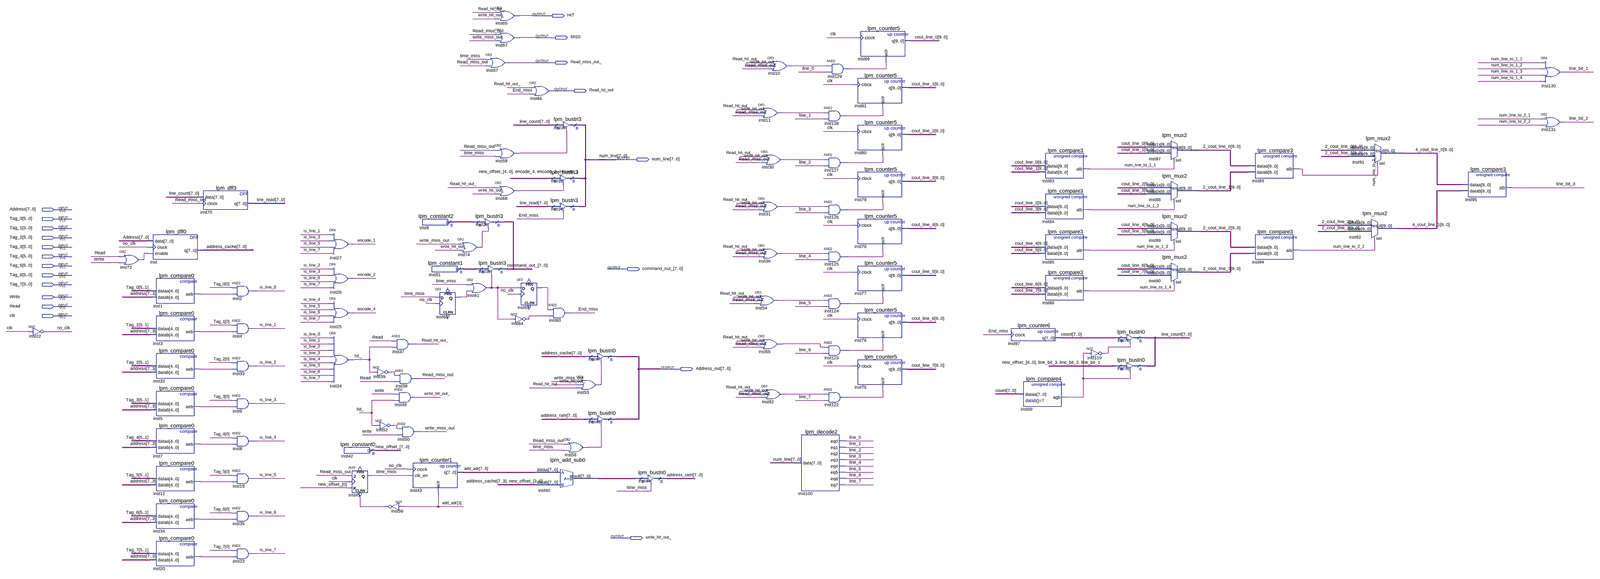
[diagram p0: schematic sheet, whole]
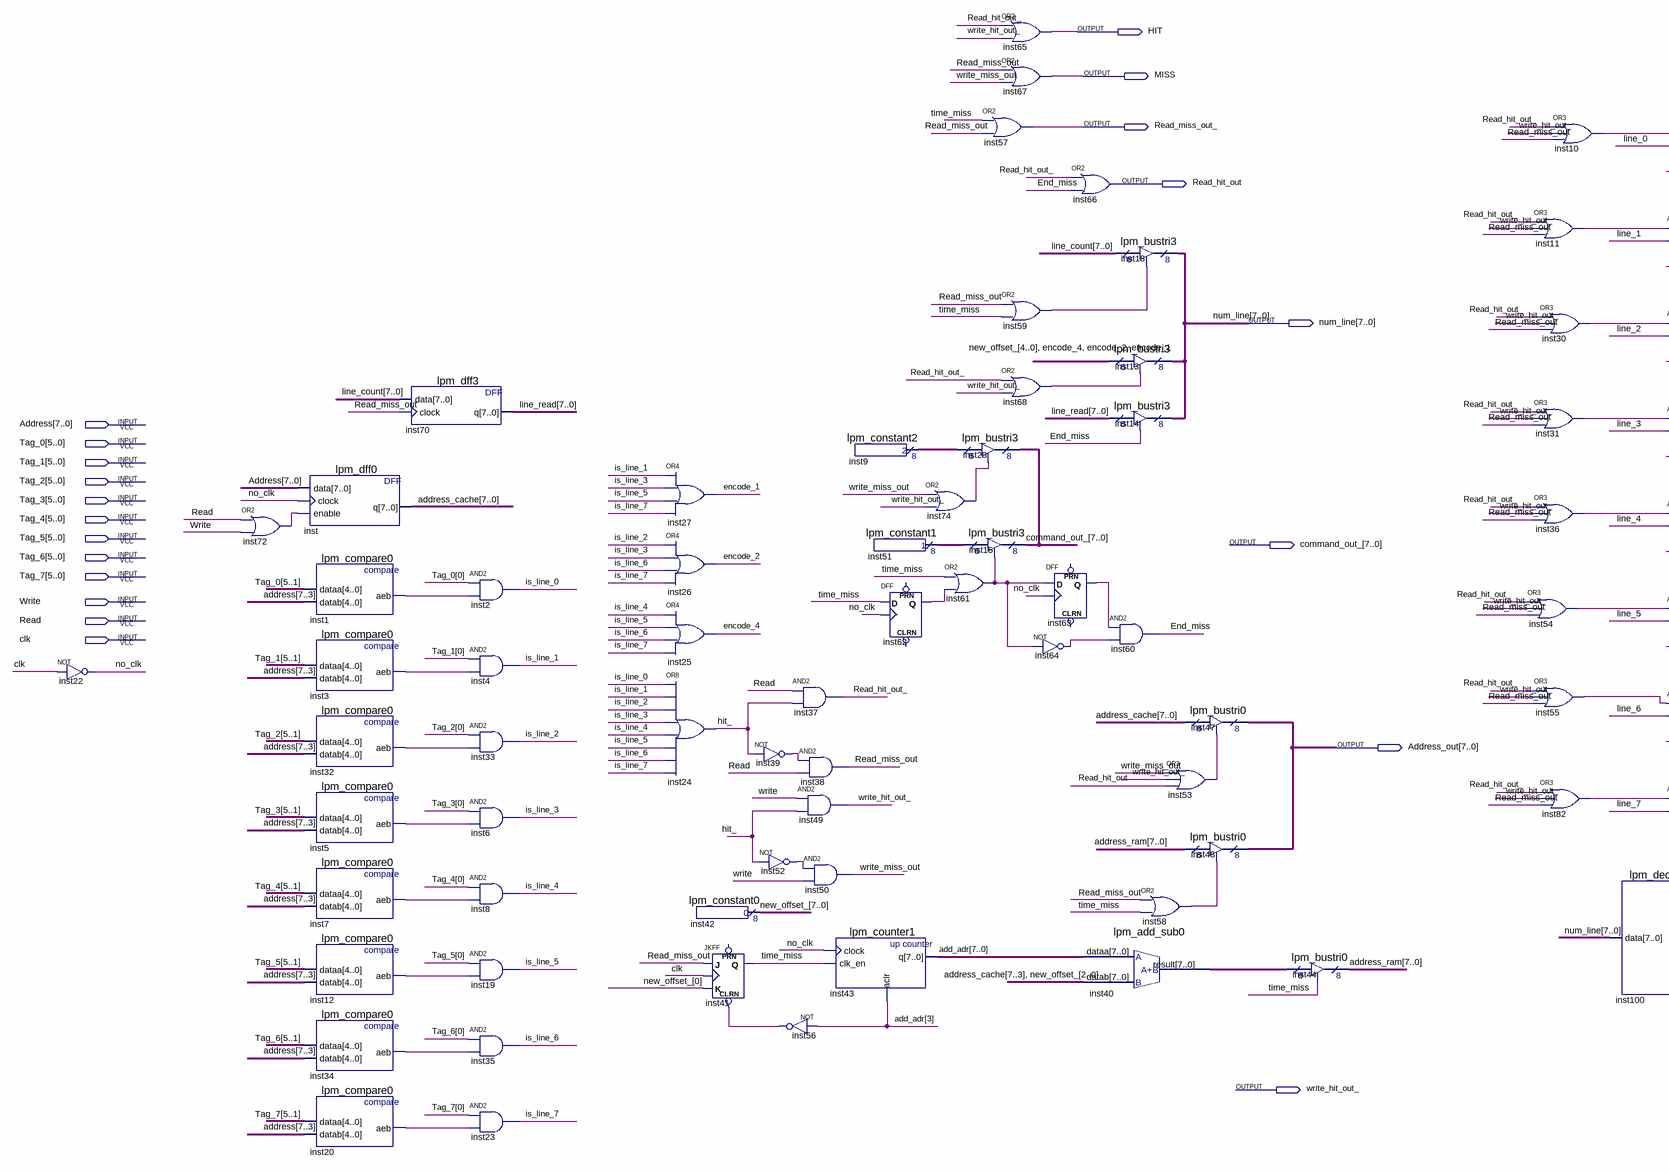
[diagram p1: schematic sheet, left part]
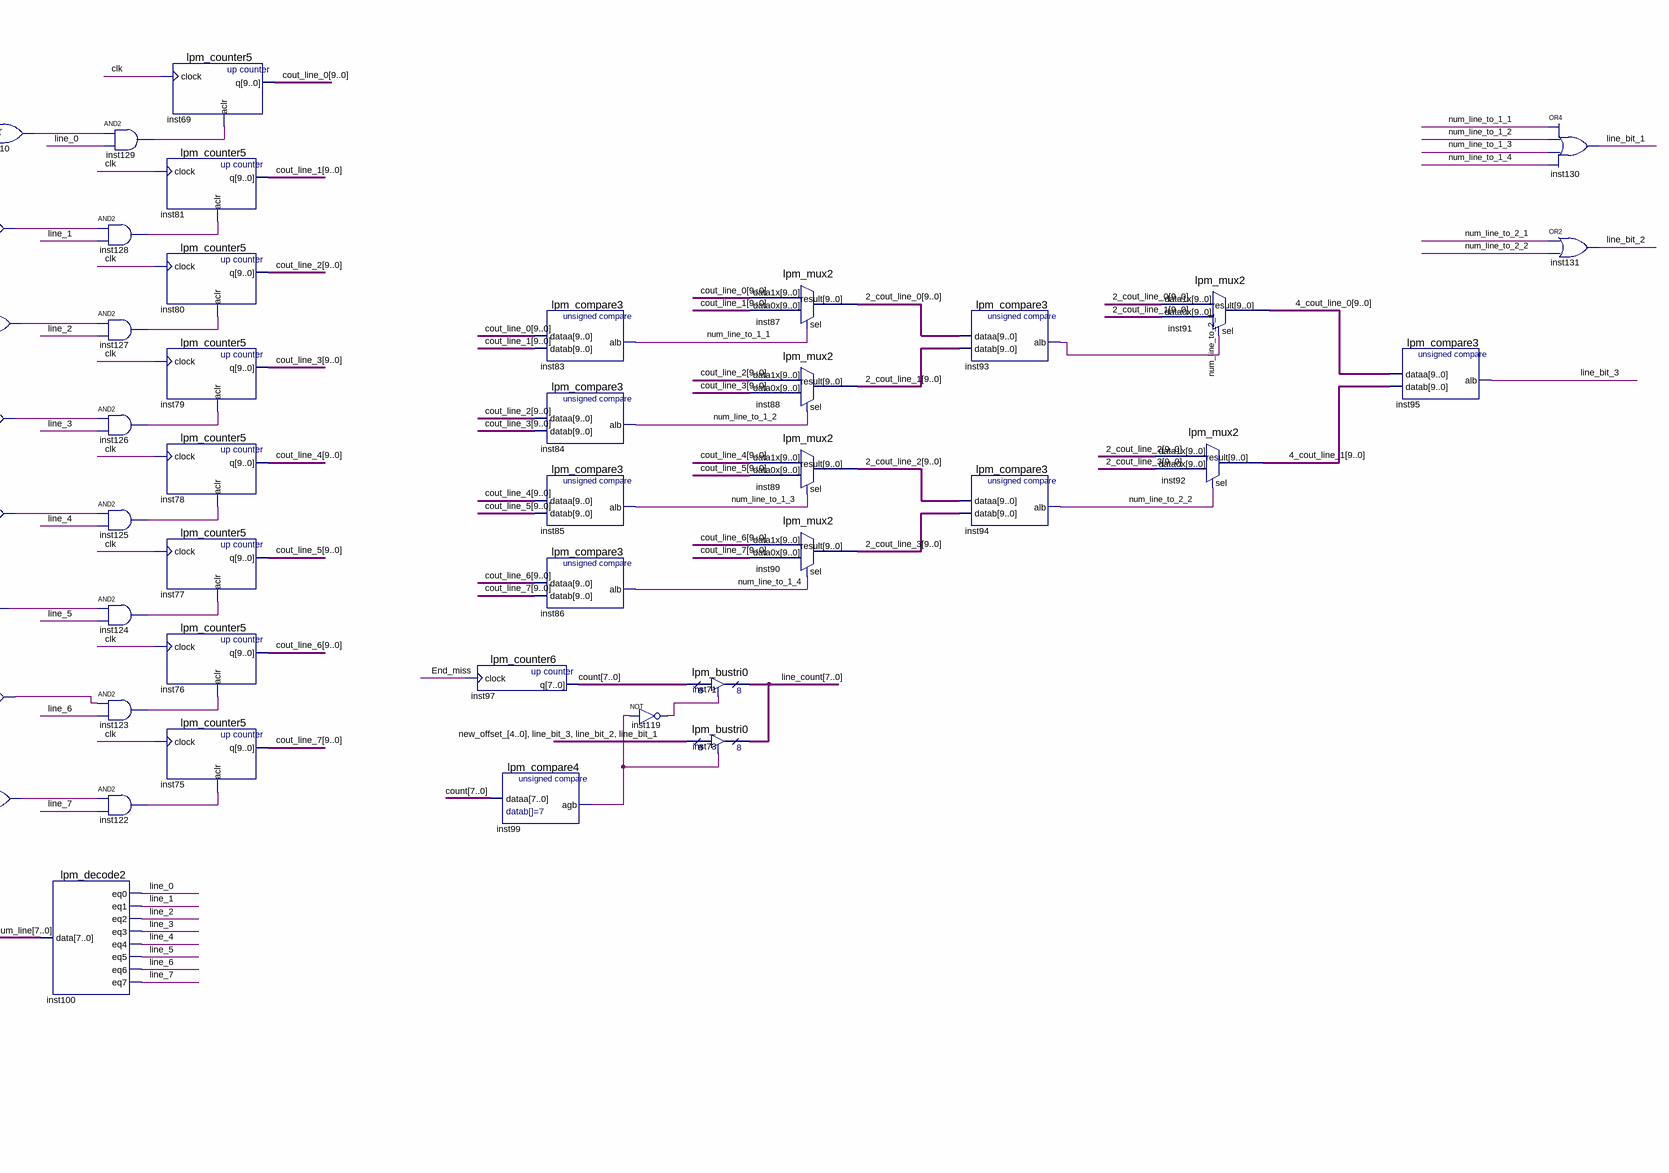
[diagram p2: schematic sheet, right part]
// Quartus schematic cache_control.bdf as structural Verilog: 104 symbols, 20 pins
module cache_control (
  input  [7:0] Address,
  input  [5:0] Tag_0,
  input  [5:0] Tag_1,
  input  [5:0] Tag_2,
  input  [5:0] Tag_3,
  input  [5:0] Tag_4,
  input  [5:0] Tag_5,
  input  [5:0] Tag_6,
  input  [5:0] Tag_7,
  input  Write,
  input  Read,
  input  clk,
  output HIT,
  output MISS,
  output Read_miss_out_,
  output Read_hit_out,
  output [7:0] num_line,
  output [7:0] command_out_,
  output [7:0] Address_out,
  output write_hit_out_
);

  wire encode_1, encode_2, encode_4, End_miss, hit_, inst1_aeb, inst3_aeb, inst5_aeb, inst7_aeb, inst10_out,
       inst11_out, inst12_aeb, inst20_aeb, inst30_out, inst31_out, inst32_aeb, inst34_aeb, inst36_out,
       inst39_out, inst52_out, inst53_out, inst54_out, inst55_out, inst56_out, inst58_out, inst59_out,
       inst61_out, inst62_q, inst63_q, inst64_out, inst68_out, inst72_out, inst74_out, inst82_out,
       inst99_agb, inst119_out, inst122_out, inst123_out, inst124_out, inst125_out, inst126_out, inst127_out,
       inst128_out, inst129_out, is_line_0, is_line_1, is_line_2, is_line_3, is_line_4, is_line_5, is_line_6,
       is_line_7, line_0, line_1, line_2, line_3, line_4, line_5, line_6, line_7, line_bit_1, line_bit_2,
       line_bit_3, no_clk, num_line_to_1_1, num_line_to_1_2, num_line_to_1_3, num_line_to_1_4,
       num_line_to_2_1, num_line_to_2_2, Read_hit_out_, Read_miss_out, time_miss, write_miss_out;
  wire [7:0] add_adr, address_cache, address_ram, count, inst9_result, inst40_result, inst51_result,
       line_count, line_read, new_offset_;
  wire [9:0] \2_cout_line_0 , \2_cout_line_1 , \2_cout_line_2 , \2_cout_line_3 , \4_cout_line_0 ,
       \4_cout_line_1 , cout_line_0, cout_line_1, cout_line_2, cout_line_3, cout_line_4, cout_line_5,
       cout_line_6, cout_line_7;

  not inst22 (no_clk, clk);
  or inst72 (inst72_out, Read, Write);
  lpm_dff0 inst (.data(Address), .clock(no_clk), .enable(inst72_out), .q(address_cache));
  lpm_compare0 inst1 (.dataa(Tag_0[5:1]), .datab(Address[7:3]), .aeb(inst1_aeb));
  lpm_compare0 inst3 (.dataa(Tag_1[5:1]), .datab(Address[7:3]), .aeb(inst3_aeb));
  lpm_compare0 inst32 (.dataa(Tag_2[5:1]), .datab(Address[7:3]), .aeb(inst32_aeb));
  lpm_compare0 inst5 (.dataa(Tag_3[5:1]), .datab(Address[7:3]), .aeb(inst5_aeb));
  lpm_compare0 inst7 (.dataa(Tag_4[5:1]), .datab(Address[7:3]), .aeb(inst7_aeb));
  lpm_compare0 inst12 (.dataa(Tag_5[5:1]), .datab(Address[7:3]), .aeb(inst12_aeb));
  lpm_compare0 inst34 (.dataa(Tag_6[5:1]), .datab(Address[7:3]), .aeb(inst34_aeb));
  lpm_compare0 inst20 (.dataa(Tag_7[5:1]), .datab(Address[7:3]), .aeb(inst20_aeb));
  lpm_dff3 inst70 (.data(line_count), .clock(Read_miss_out), .q(line_read));
  and inst2 (is_line_0, Tag_0[0], inst1_aeb);
  and inst4 (is_line_1, Tag_1[0], inst3_aeb);
  and inst33 (is_line_2, Tag_2[0], inst32_aeb);
  and inst6 (is_line_3, Tag_3[0], inst5_aeb);
  and inst8 (is_line_4, Tag_4[0], inst7_aeb);
  and inst19 (is_line_5, Tag_5[0], inst12_aeb);
  and inst35 (is_line_6, Tag_6[0], inst34_aeb);
  and inst23 (is_line_7, Tag_7[0], inst20_aeb);
  or inst27 (encode_1, is_line_1, is_line_3, is_line_5, is_line_7);
  or inst26 (encode_2, is_line_2, is_line_3, is_line_6, is_line_7);
  or inst25 (encode_4, is_line_4, is_line_5, is_line_6, is_line_7);
  or inst24 (hit_, is_line_0, is_line_1, is_line_2, is_line_3, is_line_4, is_line_5, is_line_6, is_line_7);
  lpm_constant0 inst42 (.result(new_offset_));
  JKFF inst41 (.CLRN(inst56_out), .K(new_offset_[0]), .J(Read_miss_out), .CLK(clk), .Q(time_miss));  // open: PRN
  not inst39 (inst39_out, hit_);
  not inst52 (inst52_out, hit_);
  and inst37 (Read_hit_out_, Read, hit_);
  and inst38 (Read_miss_out, inst39_out, Read);
  and inst49 (write_hit_out_, Write, hit_);
  and inst50 (write_miss_out, inst52_out, Write);
  not inst56 (inst56_out, add_adr[3]);
  lpm_constant2 inst9 (.result(inst9_result));
  lpm_counter1 inst43 (.clock(no_clk), .clk_en(time_miss), .aclr(add_adr[3]), .q(add_adr));
  lpm_constant1 inst51 (.result(inst51_result));
  DFF inst62 (.CLK(no_clk), .D(time_miss), .Q(inst62_q));  // open: CLRN, PRN
  lpm_bustri3 inst28 (.enabledt(inst74_out), .data(inst9_result), .tridata(command_out_));
  or inst74 (inst74_out, write_miss_out, write_hit_out_);
  or inst61 (inst61_out, time_miss, inst62_q);
  or inst65 (HIT, Read_hit_out_, write_hit_out_);
  or inst67 (MISS, Read_miss_out, write_miss_out);
  or inst57 (Read_miss_out_, time_miss, Read_miss_out);
  or inst59 (inst59_out, Read_miss_out, time_miss);
  or inst68 (inst68_out, Read_hit_out_, write_hit_out_);
  lpm_bustri3 inst15 (.enabledt(inst61_out), .data(inst51_result), .tridata(command_out_));
  DFF inst63 (.CLK(no_clk), .D(inst61_out), .Q(inst63_q));  // open: CLRN, PRN
  not inst64 (inst64_out, inst61_out);
  or inst66 (Read_hit_out, Read_hit_out_, End_miss);
  lpm_bustri3 inst13 (
    .enabledt(inst68_out), .data({new_offset_[4:0], encode_4, encode_2, encode_1}), .tridata(num_line));
  lpm_bustri3 inst14 (.enabledt(End_miss), .data(line_read), .tridata(num_line));
  and inst60 (End_miss, inst63_q, inst64_out);
  lpm_add_sub0 inst40 (.dataa(add_adr), .datab({address_cache[7:3], new_offset_[2:0]}), .result(inst40_result));
  lpm_bustri3 inst18 (.enabledt(inst59_out), .data(line_count), .tridata(num_line));
  or inst58 (inst58_out, Read_miss_out, time_miss);
  lpm_bustri0 inst47 (.enabledt(inst53_out), .data(address_cache), .tridata(Address_out));
  or inst53 (inst53_out, write_miss_out, write_hit_out_, Read_hit_out);
  lpm_bustri0 inst48 (.enabledt(inst58_out), .data(address_ram), .tridata(Address_out));
  lpm_bustri0 inst44 (.enabledt(time_miss), .data(inst40_result), .tridata(address_ram));
  or inst10 (inst10_out, Read_hit_out_, write_hit_out_, Read_miss_out);
  or inst11 (inst11_out, Read_hit_out_, write_hit_out_, Read_miss_out);
  or inst30 (inst30_out, Read_hit_out_, write_hit_out_, Read_miss_out);
  or inst31 (inst31_out, Read_hit_out_, write_hit_out_, Read_miss_out);
  or inst36 (inst36_out, Read_hit_out_, write_hit_out_, Read_miss_out);
  or inst54 (inst54_out, Read_hit_out_, write_hit_out_, Read_miss_out);
  or inst55 (inst55_out, Read_hit_out_, write_hit_out_, Read_miss_out);
  or inst82 (inst82_out, Read_hit_out_, write_hit_out_, Read_miss_out);
  lpm_decode2 inst100 (
    .data(num_line), .eq0(line_0), .eq1(line_1), .eq2(line_2), .eq3(line_3), .eq4(line_4), .eq5(line_5),
    .eq6(line_6), .eq7(line_7));
  and inst128 (inst128_out, inst11_out, line_1);
  and inst127 (inst127_out, inst30_out, line_2);
  and inst126 (inst126_out, inst31_out, line_3);
  and inst125 (inst125_out, inst36_out, line_4);
  and inst124 (inst124_out, inst54_out, line_5);
  and inst123 (inst123_out, inst55_out, line_6);
  and inst122 (inst122_out, inst82_out, line_7);
  and inst129 (inst129_out, inst10_out, line_0);
  lpm_counter5 inst69 (.clock(clk), .aclr(inst129_out), .q(cout_line_0));
  lpm_counter5 inst81 (.clock(clk), .aclr(inst128_out), .q(cout_line_1));
  lpm_counter5 inst80 (.clock(clk), .aclr(inst127_out), .q(cout_line_2));
  lpm_counter5 inst79 (.clock(clk), .aclr(inst126_out), .q(cout_line_3));
  lpm_counter5 inst78 (.clock(clk), .aclr(inst125_out), .q(cout_line_4));
  lpm_counter5 inst77 (.clock(clk), .aclr(inst124_out), .q(cout_line_5));
  lpm_counter5 inst76 (.clock(clk), .aclr(inst123_out), .q(cout_line_6));
  lpm_counter5 inst75 (.clock(clk), .aclr(inst122_out), .q(cout_line_7));
  lpm_counter6 inst97 (.clock(End_miss), .q(count));
  lpm_compare4 inst99 (.dataa(count), .agb(inst99_agb));
  lpm_compare3 inst83 (.dataa(cout_line_0), .datab(cout_line_1), .alb(num_line_to_1_1));
  lpm_compare3 inst84 (.dataa(cout_line_2), .datab(cout_line_3), .alb(num_line_to_1_2));
  lpm_compare3 inst85 (.dataa(cout_line_4), .datab(cout_line_5), .alb(num_line_to_1_3));
  lpm_compare3 inst86 (.dataa(cout_line_6), .datab(cout_line_7), .alb(num_line_to_1_4));
  not inst119 (inst119_out, inst99_agb);
  lpm_bustri0 inst71 (.enabledt(inst119_out), .data(count), .tridata(line_count));
  lpm_bustri0 inst73 (
    .enabledt(inst99_agb), .data({new_offset_[4:0], line_bit_3, line_bit_2, line_bit_1}), .tridata(line_count));
  lpm_mux2 inst87 (.data1x(cout_line_0), .data0x(cout_line_1), .sel(num_line_to_1_1), .result(\2_cout_line_0 ));
  lpm_mux2 inst88 (.data1x(cout_line_2), .data0x(cout_line_3), .sel(num_line_to_1_2), .result(\2_cout_line_1 ));
  lpm_mux2 inst89 (.data1x(cout_line_4), .data0x(cout_line_5), .sel(num_line_to_1_3), .result(\2_cout_line_2 ));
  lpm_mux2 inst90 (.data1x(cout_line_6), .data0x(cout_line_7), .sel(num_line_to_1_4), .result(\2_cout_line_3 ));
  lpm_compare3 inst93 (.dataa(\2_cout_line_0 ), .datab(\2_cout_line_1 ), .alb(num_line_to_2_1));
  lpm_compare3 inst94 (.dataa(\2_cout_line_2 ), .datab(\2_cout_line_3 ), .alb(num_line_to_2_2));
  lpm_mux2 inst91 (.data1x(\2_cout_line_0 ), .data0x(\2_cout_line_1 ), .sel(num_line_to_2_1), .result(\4_cout_line_0 ));
  lpm_mux2 inst92 (.data1x(\2_cout_line_2 ), .data0x(\2_cout_line_3 ), .sel(num_line_to_2_2), .result(\4_cout_line_1 ));
  lpm_compare3 inst95 (.dataa(\4_cout_line_0 ), .datab(\4_cout_line_1 ), .alb(line_bit_3));
  or inst130 (line_bit_1, num_line_to_1_1, num_line_to_1_2, num_line_to_1_3, num_line_to_1_4);
  or inst131 (line_bit_2, num_line_to_2_1, num_line_to_2_2);
endmodule
